# Altium schematic sheet IC.SchDoc: IC
size A4; Organization: My Company; Address1: Address Line 1; Address2: Address Line 2; Address3: Address Line 3; Address4: Address Line 4; SheetNumber: 3; SheetTotal: 4; ProjectTitle: Module_Ethernet_W5500
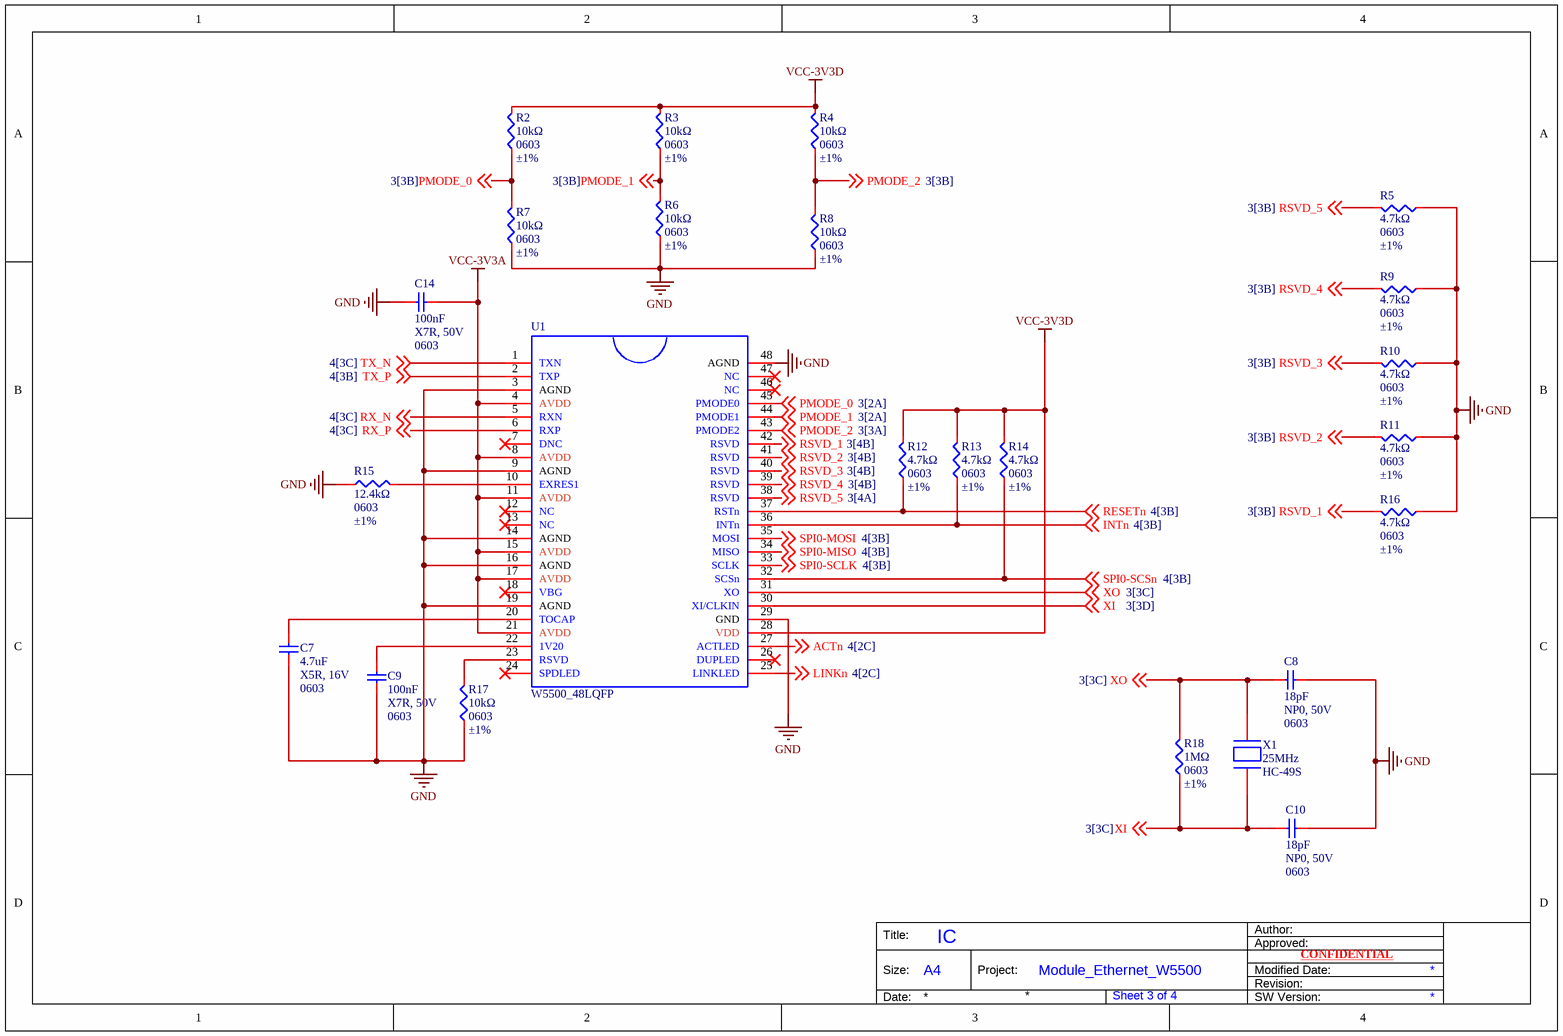
[diagram p0: IC.SchDoc]

## Parts
C7  4.7uF  Temperature Coefficient: X5R, 16V  Package: 0603  [C0603]
C8  18pF  Temperature Coefficient: NP0, 50V  Package: 0603  [C0603]
C9  100nF  Temperature Coefficient: X7R, 50V  Package: 0603  [C0603]
C10  18pF  Temperature Coefficient: NP0, 50V  Package: 0603  [C0603]
C14  100nF  Temperature Coefficient: X7R, 50V  Package: 0603  [C0603]
R2  10kΩ  Package: 0603  Tolerance: ±1%  [R0603]
R3  10kΩ  Package: 0603  Tolerance: ±1%  [R0603]
R4  10kΩ  Package: 0603  Tolerance: ±1%  [R0603]
R5  4.7kΩ  Package: 0603  Tolerance: ±1%  [R0603]
R6  10kΩ  Package: 0603  Tolerance: ±1%  [R0603]
R7  10kΩ  Package: 0603  Tolerance: ±1%  [R0603]
R8  10kΩ  Package: 0603  Tolerance: ±1%  [R0603]
R9  4.7kΩ  Package: 0603  Tolerance: ±1%  [R0603]
R10  4.7kΩ  Package: 0603  Tolerance: ±1%  [R0603]
R11  4.7kΩ  Package: 0603  Tolerance: ±1%  [R0603]
R12  4.7kΩ  Package: 0603  Tolerance: ±1%  [R0603]
R13  4.7kΩ  Package: 0603  Tolerance: ±1%  [R0603]
R14  4.7kΩ  Package: 0603  Tolerance: ±1%  [R0603]
R15  12.4kΩ  Package: 0603  Tolerance: ±1%  [R0603]
R16  4.7kΩ  Package: 0603  Tolerance: ±1%  [R0603]
R17  10kΩ  Package: 0603  Tolerance: ±1%  [R0603]
R18  1MΩ  Package: 0603  Tolerance: ±1%  [R0603]
U1  W5500_48LQFP  [48LQFP (7*7)]
X1  25MHz  [HC-49S]

## Nets
GND: C7.1 C8.2 C9.1 C10.2 C14.2 R5.1 R6.1 R7.1 R8.1 R9.1 R10.1 R11.1 R15.1 R16.1 R17.1 U1.3(AGND) U1.9(AGND) U1.14(AGND) U1.16(AGND) U1.19(AGND) U1.29(GND) U1.48(AGND)
VCC-3V3A: C14.1 U1.4(AVDD) U1.8(AVDD) U1.11(AVDD) U1.15(AVDD) U1.17(AVDD) U1.21(AVDD)
VCC-3V3D: R2.2 R3.2 R4.2 R12.2 R13.2 R14.2 U1.28(VDD)
ACTn: U1.27(ACTLED) ; off-sheet ACTn
INTn: R13.1 U1.36(INTn) ; off-sheet INTn
LINKn: U1.25(LINKLED) ; off-sheet LINKn
PMODE_0: R2.1 R7.2 U1.45(PMODE0) ; off-sheet PMODE_0
PMODE_1: R3.1 R6.2 U1.44(PMODE1) ; off-sheet PMODE_1
PMODE_2: R4.1 R8.2 U1.43(PMODE2) ; off-sheet PMODE_2
RESETn: R12.1 U1.37(RSTn) ; off-sheet RESETn
RSVD_1: R16.2 U1.42(RSVD) ; off-sheet RSVD_1
RSVD_2: R11.2 U1.41(RSVD) ; off-sheet RSVD_2
RSVD_3: R10.2 U1.40(RSVD) ; off-sheet RSVD_3
RSVD_4: R9.2 U1.39(RSVD) ; off-sheet RSVD_4
RSVD_5: R5.2 U1.38(RSVD) ; off-sheet RSVD_5
RX_N: U1.5(RXN) ; off-sheet RX_N
RX_P: U1.6(RXP) ; off-sheet RX_P
SPI0-MISO: U1.34(MISO) ; off-sheet SPI0-MISO
SPI0-MOSI: U1.35(MOSI) ; off-sheet SPI0-MOSI
SPI0-SCLK: U1.33(SCLK) ; off-sheet SPI0-SCLK
SPI0-SCSn: R14.1 U1.32(SCSn) ; off-sheet SPI0-SCSn
TX_N: U1.1(TXN) ; off-sheet TX_N
TX_P: U1.2(TXP) ; off-sheet TX_P
XI: C10.1 R18.1 U1.30(XI/CLKIN) X1.1 ; off-sheet XI
XO: C8.1 R18.2 U1.31(XO) X1.2 ; off-sheet XO
NetC7_2: C7.2 U1.20(TOCAP)
NetC9_2: C9.2 U1.22(1V20)
NetR15_2: R15.2 U1.10(EXRES1)
NetR17_2: R17.2 U1.23(RSVD)

Not connected (* = marked no-connect by the designer): U1 7(DNC)* 12(NC)* 13(NC)* 18(VBG)* 24(SPDLED)* 26(DUPLED)* 46(NC)* 47(NC)*

## Notes on the sheet
- Author:
- Title:
- Size:
- A4
- Project:
- Approved:
- Revision:
- Modified Date:
- CONFIDENTIAL
- Date:
- SW Version:

## Library data of the parts
C7 = C0603_MLCC_4.7uF_X5R_16V: 4.7uF ±10% 16V Ceramic Capacitor X5R 0603; Manufacturer: Samsung Electro-Mechanics; Mfr. Part: CL10A475KO8NNNC; LCSC Part: C19666; Capacitance: 4.7uF; Link: https://www.lcsc.com/product-detail/C19666.html; Voltage Rating: 16V; Tolerance: ±10%
C8 C10 = C0603_MLCC_18pF_NP0_50V: 18pF ±5% 50V Ceramic Capacitor NP0 0603; Manufacturer: YAGEO; Mfr. Part: CC0603JRNPO9BN180; LCSC Part: C107040; Capacitance: 18pF; Link: https://www.lcsc.com/product-detail/C107040.html; Tolerance: ±5%; Voltage Rating: 50V
C9 C14 = C0603_MLCC_100nF_X7R_50V: 50V 100nF X7R ±10% 0603 Multilayer Ceramic Capacitors MLCC - SMD/SMT ROHS; Manufacturer: YAGEO; Mfr. Part: CC0603KRX7R9BB104; LCSC Part: C14663; Capacitance: 100nF; Link: https://www.lcsc.com/product-detail/C14663.html; Tolerance: ±10%; Voltage Rating: 50V
R2-R4 R6-R8 R17 = R0603_10kΩ_±1%: 100mW Thick Film Resistor 75V ±100ppm/℃ ±1% 10kΩ 0603 Chip Resistor - Surface Mount ROHS; Manufacturer: YAGEO; Mfr. Part: RC0603FR-0710KL; LCSC Part: C98220; Resistance: 10kΩ; Operating Temperature: -55℃~+155℃; Link: https://www.lcsc.com/product-detail/C98220.html
R5 R9-R14 R16 = R0603_4.7kΩ_±1%: 100mW Thick Film Resistor 75V ±100ppm/℃ ±1% 4.7kΩ 0603 Chip Resistor - Surface Mount ROHS; Manufacturer: YAGEO; Mfr. Part: RC0603FR-074K7L; LCSC Part: C99782; Resistance: 4.7kΩ; Operating Temperature: -55℃~+155℃; Link: https://www.lcsc.com/product-detail/C99782.html
R15 = R0603_12.4kΩ_±1%: 100mW 12.4kΩ 75V Thick Film Resistor ±100ppm/℃ ±1% 0603 Chip Resistor - Surface Mount RoHS; Manufacturer: YAGEO; Mfr. Part: RC0603FR-0712K4L; LCSC Part: C137798; Resistance: 12.4kΩ; Operating Temperature: -55℃~+155℃; Link: https://www.lcsc.com/product-detail/C137798.html
R18 = R0603_1MΩ_±1%: 100mW Thick Film Resistor 75V ±100ppm/℃ ±1% 1MΩ 0603 Chip Resistor - Surface Mount ROHS; Manufacturer: YAGEO; Mfr. Part: RC0603FR-071ML; LCSC Part: C105578; Resistance: 1MΩ; Operating Temperature: -55℃~+155℃; Link: https://www.lcsc.com/product-detail/C105578.html
U1 = W5500_48LQFP: LQFP-48(7x7) Interface Controllers RoHS; Manufacturer: WIZNETTHE TICKET; Mfr. Part: TPS61175PWPR; Voltage - Supply: 3.3V; Ethernet Speed Standards: 10BASE-T; 100BASE-TX; Protocol: SPI; Memory Space: 32KB; Number of Channels: 8; Package: LQFP-48(7x7); LCSC Part: C32843; Link: https://www.lcsc.com/product-detail/C32843.html?s_z=n_w5500%252048lqfp; MAC Interface: SPI; Operating Temperature: -40℃~+85℃
X1 = Crystal_25Mhz_HC49S: Crystal 25MHz ±20ppm 20pF HC-49S; Manufacturer: YXC Crystal Oscillators; Mfr. Part: X49SD25MSD2SC; Frequency Stability: ±30ppm; LCSC Part: C14730; Frequency: 25MHz; Type: Through Hole Crystal Oscillator; Load Capacitance: 20pF; Operating Temperature: -20℃~+70℃; Link: https://www.lcsc.com/product-detail/C14730.html; Package: HC-49S